# EAGLE design smartstickSTM32f072 (EAGLE 6.5.0)
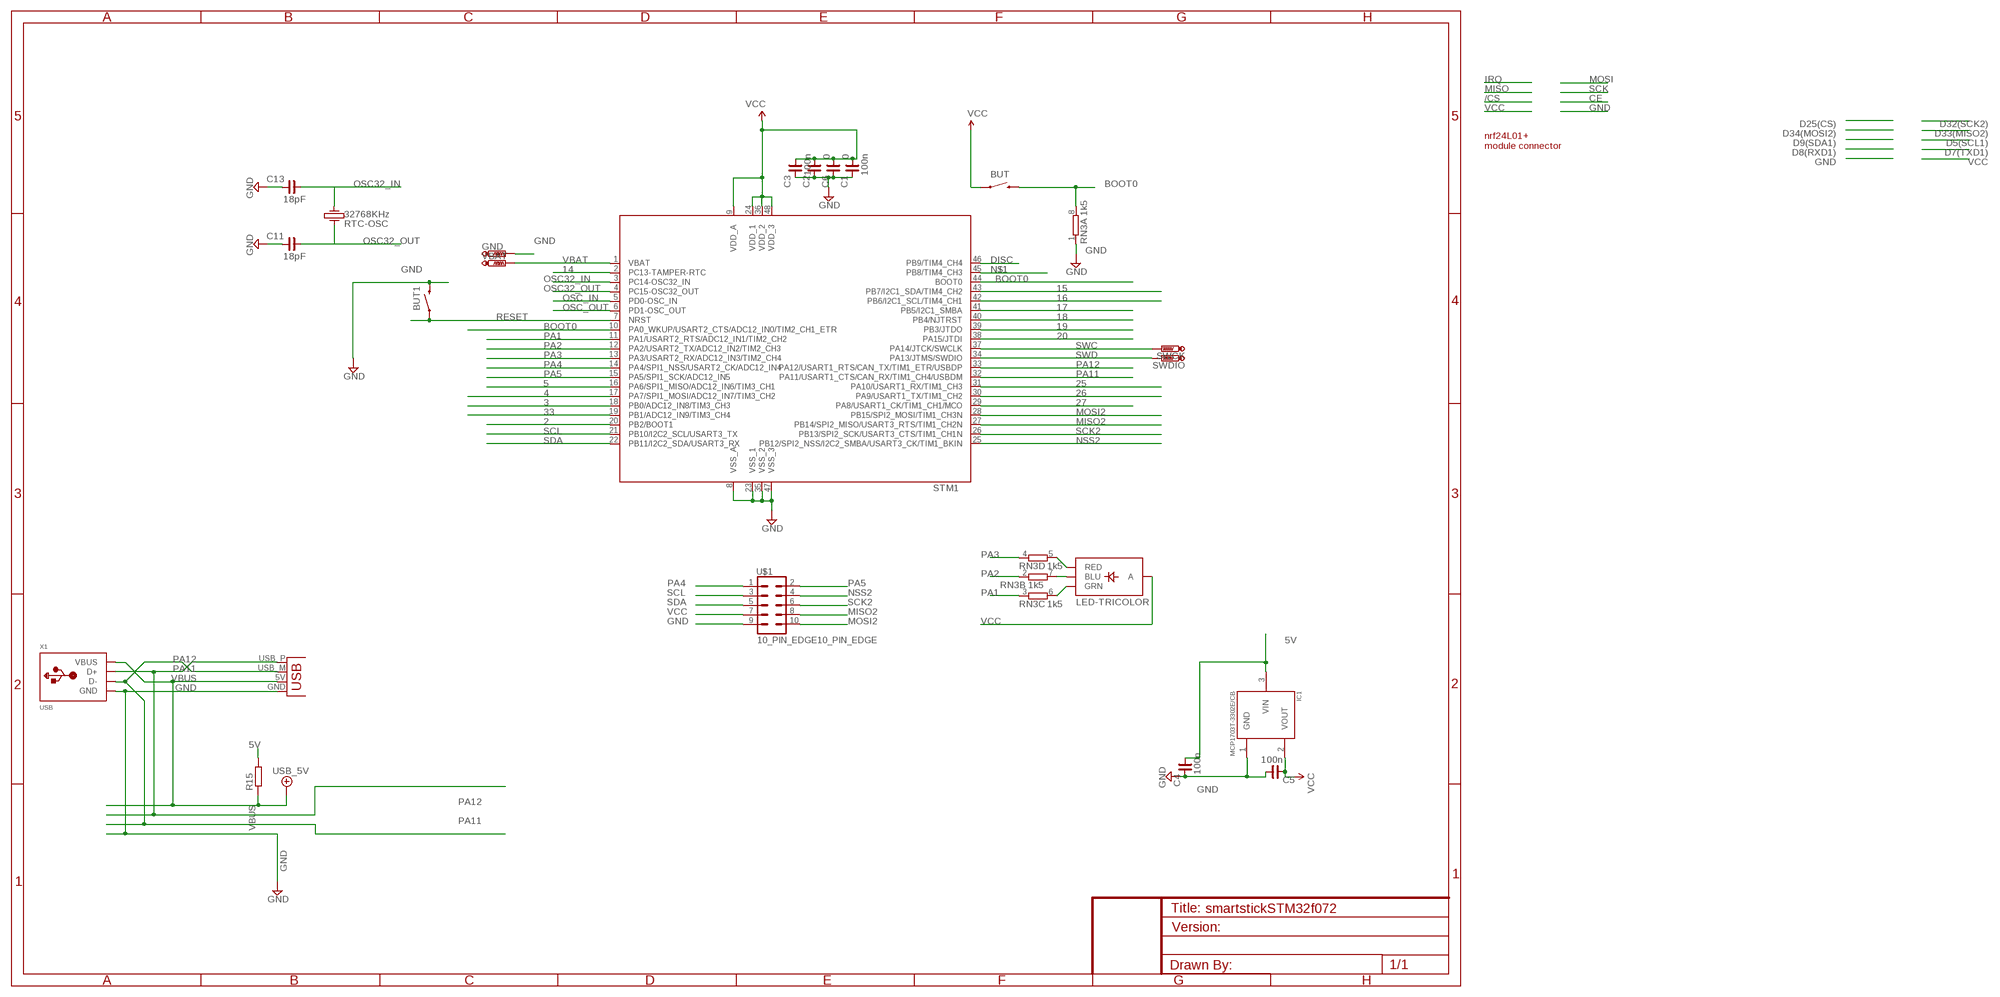
[diagram p0: schematic, sheet 1]

## Parts
BUT  SWITCH-MOMENTARY-2-SMD-1101NE  [TACTILE-SWITCH-1101NE]
BUT1  SWITCH-MOMENTARY-2-SMD-1101NE  [TACTILE-SWITCH-1101NE]
C1  100n  C_0603  [C0603]
C2  0  C_0603  [C0603]
C3  100n  C_0603  [C0603]
C4  100n  C_0603  [C0603]
C5  100n  C_0603  [C0603]
C6  0  C_0603  [C0603]
C11  18pF  C_0603  [C0603]
C13  18pF  C_0603  [C0603]
GND  PTR1TP20SQ  [TP20SQ]
IC1  MCP1703T-3302E/CB  MCP1700T  [SOT23]
R15  R-EU_R0603  [R0603]
RN3  1k5  4R-NEXB38V  [EXB38V]
RTC-OSC  32768KHz  CRYSTALL  [KX-327LT]
STM1  STM32F103CB  [LQFP48]
SWCK  PTR1TP16R  [TP16R]
SWDIO  PTR1TP16R  [TP16R]
U$1  10_PIN_EDGE10_PIN_EDGE  [10_PIN_EDGE]
U$3  LED-TRICOLOR  [LED-TRICOLOR-SMD]
VBAT  PTR1TP19R  [TP19R]
X1  USB  [MOLEX-48037-1000]
X3  USBPCB  [USB-A-PCB]

## Nets
2: STM1.20(PB2/BOOT1)
3: STM1.18(PB0/ADC12_IN8/TIM3_CH3)
4: STM1.17(PA7/SPI1_MOSI/ADC12_IN7/TIM3_CH2)
5: STM1.16(PA6/SPI1_MISO/ADC12_IN6/TIM3_CH1)
5V [vcc]: C4.1 IC1.3(VIN) R15.2
14: STM1.2(PC13-TAMPER-RTC)
15: STM1.43(PB7/I2C1_SDA/TIM4_CH2)
16: STM1.42(PB6/I2C1_SCL/TIM4_CH1)
17: STM1.41(PB5/I2C1_SMBA)
18: STM1.40(PB4/NJTRST)
19: STM1.39(PB3/JTDO)
20: STM1.38(PA15/JTDI)
25: STM1.31(PA10/USART1_RX/TIM1_CH3)
26: STM1.30(PA9/USART1_TX/TIM1_CH2)
27: STM1.29(PA8/USART1_CK/TIM1_CH1/MCO)
33: STM1.19(PB1/ADC12_IN9/TIM3_CH4)
BOOT0: BUT.P$2 RN3.8 STM1.10(PA0_WKUP/USART2_CTS/ADC12_IN0/TIM2_CH1_ETR) STM1.44(BOOT0)
DISC: STM1.46(PB9/TIM4_CH4)
GND [vcc]: BUT1.P$2 C1.2 C2.2 C3.2 C4.2 C5.1 C6.2 C11.2 C13.2 GND.TP IC1.1(GND) RN3.1 STM1.8(VSS_A) STM1.23(VSS_1) STM1.35(VSS_2) STM1.47(VSS_3) U$1.9 X1.4(GND) X3.GND
MISO2: STM1.27(PB14/SPI2_MISO/USART3_RTS/TIM1_CH2N) U$1.8
MOSI2: STM1.28(PB15/SPI2_MOSI/TIM1_CH3N) U$1.10
N$1: STM1.45(PB8/TIM4_CH3)
N$2: RN3.5 U$3.R(RED)
N$3: RN3.7 U$3.B(BLU)
N$4: RN3.6 U$3.G(GRN)
NSS2: STM1.25(PB12/SPI2_NSS/I2C2_SMBA/USART3_CK/TIM1_BKIN) U$1.4
OSC32_IN: C13.1 RTC-OSC.1 STM1.3(PC14-OSC32_IN)
OSC32_OUT: C11.1 RTC-OSC.4 STM1.4(PC15-OSC32_OUT)
OSC_IN: STM1.5(PD0-OSC_IN)
OSC_OUT: STM1.6(PD1-OSC_OUT)
PA1: RN3.3 STM1.11(PA1/USART2_RTS/ADC12_IN1/TIM2_CH2)
PA2: RN3.2 STM1.12(PA2/USART2_TX/ADC12_IN2/TIM2_CH3)
PA3: RN3.4 STM1.13(PA3/USART2_RX/ADC12_IN3/TIM2_CH4)
PA4: STM1.14(PA4/SPI1_NSS/USART2_CK/ADC12_IN4) U$1.1
PA5: STM1.15(PA5/SPI1_SCK/ADC12_IN5) U$1.2
PA11: STM1.32(PA11/USART1_CTS/CAN_RX/TIM1_CH4/USBDM) X1.2(D-) X3.USB_M(D-)
PA12: STM1.33(PA12/USART1_RTS/CAN_TX/TIM1_ETR/USBDP) X1.3(D+) X3.USB_P(D+)
RESET: BUT1.P$1 STM1.7(NRST)
SCK2: STM1.26(PB13/SPI2_SCK/USART3_CTS/TIM1_CH1N) U$1.6
SCL: STM1.21(PB10/I2C2_SCL/USART3_TX) U$1.3
SDA: STM1.22(PB11/I2C2_SDA/USART3_RX) U$1.5
SWC: STM1.37(PA14/JTCK/SWCLK) SWCK.TP
SWD: STM1.34(PA13/JTMS/SWDIO) SWDIO.TP
VBAT: STM1.1(VBAT) VBAT.TP
VBUS: R15.1 X1.1(VBUS) X3.5V(VBUS) ; supply symbol labelled USB_5V
VCC [vcc]: BUT.P$1 C1.1 C2.1 C3.1 C5.2 C6.1 IC1.2(VOUT) STM1.9(VDD_A) STM1.24(VDD_1) STM1.36(VDD_2) STM1.48(VDD_3) U$1.7 U$3.A

## Notes on the sheet
- nrf24L01+ 
  module connector
- BOOT0

## Library data of the parts
BUT BUT1 = SparkFun:SWITCH-MOMENTARY-2
C1-C6 C11 C13 = rc-master-smd:C_: NON-POLARIZED CAP
GND SWCK SWDIO VBAT = testpad:PTR1: TEST PIN
IC1 = okie:MCP1700T
R15 = resistor:R-EU_: RESISTOR, European symbol
RN3 = resistor-dil:4R-N: Array Chip Resistor Source: RS Component / Phycomp; OC_FARNELL: unknown; OC_NEWARK: unknown
RTC-OSC = es:CRYSTALL
STM1 = stm32:STM32F103CB
U$1 = eclibrary:10_PIN_EDGE
U$3 = SparkFun-LED:LED-TRICOLOR: Tri-Color LED SMD Proven layout and schematic for triple color LED in SMD package - common anode. Spark Fun Electronics SKU : COM-07844
X1 = todstuff:USB
X3 = SparkFun:USB: USB Connectors USB-B-PTH is fully proven SKU : PRT-00139 USB-miniB is fully proven SKU : PRT-00587 USB-A-PCB is untested. USB-A-H is throughly reviewed, but untested. Spark Fun Electronics SKU : PRT-00437 USB-B-SMT is throughly reviewed, but untested. Needs silkscreen touching up. USB-A-S has not been used/tested USB-MB-H has not been used/tested

## Net classes
0 default: width 0.178 mm, drill 0.356 mm, clearance 0.178 mm
1 vcc: width 0.178 mm, drill 0.356 mm, clearance 0.178 mm
2 pwr: width 0.178 mm, drill 0.356 mm, clearance 0.178 mm

## Board
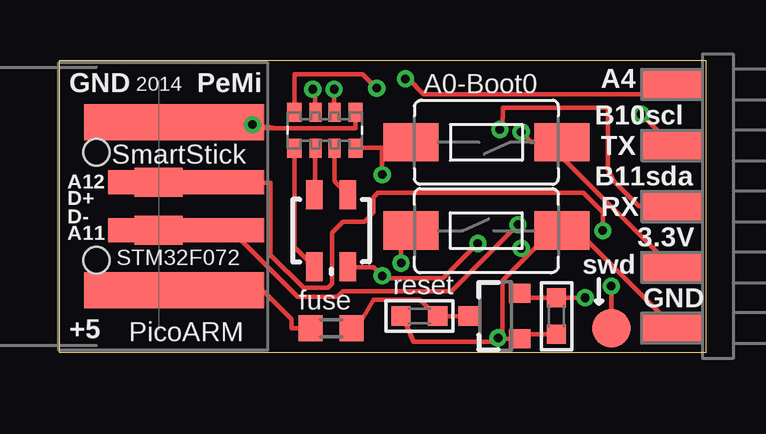
[diagram p1: board, top side]
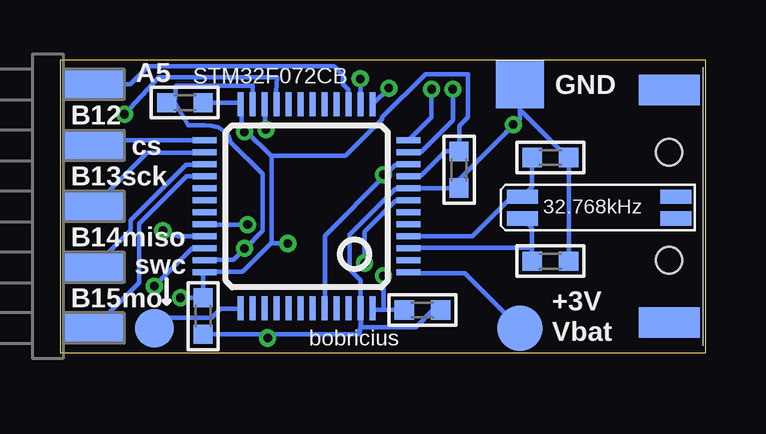
[diagram p2: board, bottom side, seen from below]

Size 26.92 x 12.19 mm. Coordinates in mm from the lower left corner, seen from the top.
Outline: 0,12.19 26.92,12.19 26.92,0 0,0 0,12.19
Copper layers (1*16): Top 0.0356mm / dielectric 1.5011mm / Bottom 0.0356mm
Design rules "LaenPCBOrder *": minimum track width 6mil, minimum drill 13mil, track to track 6mil, track to pad 6mil, pad to pad 6mil, via to via 6mil, smd to smd 6mil, copper to edge 15mil, drill to drill 6mil, minimum pad ring 7mil, minimum via ring 7mil, stop-mask expansion 3mil, vias tented up to drill 100mil, thermal gap 10mil
tRestrict: area 0.1,0.8 to 3.2,11.7
vRestrict: area 0.1,0.8 to 8,11.7

### Footprints (pad centres in the part's own frame; a part is rotated, then mirrored left to right if it is on the bottom)
TACTILE-SWITCH-1101NE = smd 2.3 x 1.6: P$1 -3.15,0; P$2 3.15,0
C0603 = smd 0.8 x 0.8: 1 -0.762,0; 2 0.762,0
TP20SQ = smd 2 x 2: TP 0,0
SOT23 = smd 0.8 x 0.9: 1 -0.95,-1; 2 0.95,-1; 3 0,1.1
R0603 = smd 1 x 1.1: 1 -0.85,0; 2 0.85,0
EXB38V = smd 0.6 x 0.8: 1 -1.275,-0.75; 4 1.275,-0.75; 5 1.275,0.75; 8 -1.275,0.75 | smd 0.5 x 0.8: 2 -0.4,-0.75; 3 0.4,-0.75; 6 0.4,0.75; 7 -0.4,0.75
KX-327LT = smd 1.3 x 0.6: 1 -3.2,-0.5; 2 3.2,-0.5; 3 3.2,0.4; 4 -3.2,0.4
LQFP48 = smd 0.254 x 1: 1 -2.75,-4.25; 2 -2.25,-4.25; 3 -1.75,-4.25; 4 -1.25,-4.25; 5 -0.75,-4.25; 6 -0.25,-4.25; 7 0.25,-4.25; 8 0.75,-4.25; 9 1.25,-4.25; 10 1.75,-4.25; 11 2.25,-4.25; 12 2.75,-4.25; 25 2.75,4.25; 26 2.25,4.25; 27 1.75,4.25; 28 1.25,4.25; 29 0.75,4.25; 30 0.25,4.25; 31 -0.25,4.25; 32 -0.75,4.25; 33 -1.25,4.25; 34 -1.75,4.25; 35 -2.25,4.25; 36 -2.75,4.25 | smd 1 x 0.254: 13 4.25,-2.75; 14 4.25,-2.25; 15 4.25,-1.75; 16 4.25,-1.25; 17 4.25,-0.75; 18 4.25,-0.25; 19 4.25,0.25; 20 4.25,0.75; 21 4.25,1.25; 22 4.25,1.75; 23 4.25,2.25; 24 4.25,2.75; 37 -4.25,2.75; 38 -4.25,2.25; 39 -4.25,1.75; 40 -4.25,1.25; 41 -4.25,0.75; 42 -4.25,0.25; 43 -4.25,-0.25; 44 -4.25,-0.75; 45 -4.25,-1.25; 46 -4.25,-1.75; 47 -4.25,-2.25; 48 -4.25,-2.75
TP16R = smd 1.6 x 1.6: TP 0,0
10_PIN_EDGE = smd 1.27 x 2.54: 1 5.08,0; 3 2.54,0; 5 0,0; 7 -2.54,0; 9 -5.08,0 | smd 1.27 x 2.54 bottom: 2 5.08,0; 4 2.54,0; 6 0,0; 8 -2.54,0; 10 -5.08,0
LED-TRICOLOR-SMD = smd 0.7 x 1.2: A 0.7,-1.5; B 0.7,1.5; G -0.7,1.5; R -0.7,-1.5
TP19R = smd 1.9 x 1.9: TP 0,0
MOLEX-48037-1000 = smd 2 x 1.2: 1 2.6,-3.5; 2 2.6,-1; 3 2.6,1; 4 2.6,3.5 | smd 2.54 x 1.27 bottom: P$1 0,4.85; P$2 0,-4.85 | hole 1.1: 0,2.25; 0,-2.25
USB-A-PCB = smd 7.5 x 1.5: 5V -0.2,-3.5; GND -0.2,3.5 | smd 6.5 x 1: USB_M 0.3,-1; USB_P 0.3,1

### Placement (x,y rotation side)
BUT  17.78,8.76 180 top
BUT1  17.78,5.08 0 top
C1  20.96,1.52 270 bottom
C2  11.81,1.78 0 bottom
C3  10.29,7.62 270 bottom
C4  14.99,1.52 180 top
C5  21.72,10.41 0 bottom
C6  20.7,1.52 270 top
C11  6.48,8.13 0 bottom
C13  6.48,3.81 0 bottom
GND  7.75,11.18 0 bottom
IC1  18.16,1.52 90 top
R15  11.3,1.02 0 top
RN3  11.05,9.27 180 top
RTC-OSC  4.45,6.1 0 bottom
STM1  16.64,6.1 90 bottom
SWCK  22.99,1.02 0 bottom
SWDIO  22.99,1.02 270 top
U$1  25.53,6.1 90 top
U$3  11.3,5.08 0 top
VBAT  7.75,1.02 0 bottom
X1  1.52,6.1 0 top
X3  4.95,6.1 0 top

### Tracks (layer width: path | path; a pad name or v marks a point on that pad's centre or on a via)
5V
  Top 0.178: IC1.3 C4.1 15.67,1.55 15.01,2.21 13.08,2.21 12.39,1.02 R15.2
BOOT0  (via drill 0.36)
  Top 0.178: 13.44,8.53 14.38,8.53 14.6,8.76 BUT.P$2 | 13.44,8.53 12.34,8.53 RN3.8 | v13.44,7.42 13.44,8.53
  Bottom 0.178: 13.39,7.37 15.88,4.88 15.88,1.85 STM1.44 | 13.39,7.37 12.93,7.82 12.39,7.82 STM1.10 | v13.44,7.42 13.39,7.37
GND  (via drill 0.36)
  Top 0.178: C6.2 19.36,0.76 19.18,0.58 IC1.1 19.07,0.58 18.44,0.58 | C4.2 14.3,1.52 14.73,0.46 18.26,0.46 | 18.44,0.58 18.26,0.46 | 19.51,4.06 18.44,3 18.44,0.58 | 19.51,4.06 20.52,5.08 BUT1.P$2 21.01,5.05 21.59,5.05 25.53,1.12 U$1.9 | 19.51,4.06 v19.23,4.34 | 9.04,9.35 5,9.35 4.77,9.58 X3.GND 3.99,9.6 X1.4 | 9.04,9.35 12.32,9.35 12.32,10.01 RN3.1 | v8.03,9.5 9.04,9.35 | v18.26,0.61 18.26,0.46
  Bottom 0.178: STM1.23 18.9,10.36 18.9,11.12 22.07,11.12 22.15,10.41 C5.1 22.1,10.36 21.59,9.47 20.88,9.47 20.62,9.45 20.32,9.4 19.94,9.14 19.81,8.76 18.47,7.44 18.47,5.08 19.21,4.33 | 19.21,4.33 19.68,3.86 20.88,3.86 STM1.35 | v19.23,4.34 19.21,4.33 | C2.2 11.38,1.78 12.09,1.07 14.38,1.07 14.38,1.32 | 14.38,1.32 14.38,1.83 STM1.47 14.4,1.93 14.4,3.02 14.86,3.48 14.86,4.9 12.93,6.83 12.47,6.83 STM1.8 12.37,6.86 C3.2 10.26,6.93 10.26,7.21 8.64,8.84 | 17.88,0.76 14.43,0.76 14.38,1.32 | 17.88,0.76 C1.2 | C13.2 C11.2 5.79,8.15 7.67,10.03 7.75,10.03 | 8.64,8.84 7.75,9.73 7.75,10.03 | GND.TP 7.75,10.03 | 8.64,8.84 v8.03,9.5 | v18.26,0.61 17.88,0.76
MISO2
  Bottom 0.178: U$1.8 23.98,5.11 23.98,5.51 21.67,7.82 20.9,7.82 STM1.27
MOSI2
  Bottom 0.178: U$1.10 23.62,2.92 23.62,5.36 21.64,7.34 20.9,7.34 STM1.28
N$2
  Top 0.178: RN3.5 9.78,8.51 9.78,4.39 10.59,3.58 U$3.R
N$3
  Top 0.178: RN3.7 11.46,8.51 11.46,7.14 11.99,6.6 U$3.B
N$4
  Top 0.178: RN3.6 10.64,8.51 10.64,6.63 10.62,6.6 U$3.G
NSS2
  Bottom 0.178: U$1.4 25.32,8.84 20.9,8.84 STM1.25
OSC32_IN
  Bottom 0.178: 7.24,4.37 7.24,5.21 7.62,5.59 RTC-OSC.1 | 7.24,4.37 C13.1 | 7.24,4.37 12.37,4.37 STM1.3
OSC32_OUT
  Bottom 0.178: C11.1 7.24,6.88 7.62,6.5 RTC-OSC.4 7.72,6.45 8.13,6.45 9.73,4.85 12.37,4.85 STM1.4
PA1  (via drill 0.36)
  Top 0.178: v10.54,10.97 10.64,10.87 RN3.3
  Bottom 0.178: v10.54,10.97 10.54,9.68 11.86,8.36 12.37,8.36 STM1.11
PA2  (via drill 0.36)
  Top 0.178: v11.43,10.97 11.43,10.03 RN3.2
  Bottom 0.178: v11.43,10.97 11.43,9.8 12.37,8.86 STM1.12
PA3  (via drill 0.36)
  Top 0.178: v13.21,11.02 12.62,11.61 9.78,11.61 RN3.4
  Bottom 0.178: v13.21,11.02 13.87,10.36 STM1.13
PA4  (via drill 0.36)
  Top 0.178: v14.4,11.41 14.53,11.41 15.16,10.77 25.12,10.77 U$1.1
  Bottom 0.178: v14.4,11.41 14.4,10.36 STM1.14
PA5
  Bottom 0.178: STM1.15 14.89,10.95 15.11,11.18 15.11,11.56 15.49,11.94 23.24,11.94 24,11.18 U$1.2
PA11  (via drill 0.36)
  Top 0.178: v19.1,5.33 16.33,2.57 11.81,2.57 11.58,2.34 9.91,2.34 7.16,5.08 5.26,5.08 X3.USB_M 5.18,5.11 4.01,5.11 X1.2
  Bottom 0.178: v19.1,5.33 STM1.32
PA12  (via drill 0.36)
  Top 0.178: v22.63,5.08 22.63,5.84 21.82,6.66 13.23,6.66 13.21,6.6 13.08,6.48 13.08,5.84 12.7,5.46 11.81,5.46 11.35,5 11.35,2.87 11.18,2.69 10.16,2.69 8.79,4.06 8.79,7.09 X3.USB_P 5.18,7.09 4.01,7.09 X1.3
  Bottom 0.178: v22.63,5.08 22.02,4.85 20.9,4.85 STM1.33
RESET  (via drill 0.36)
  Top 0.178: v14.22,3.73 14.22,4.7 14.6,5.08 BUT1.P$1
  Bottom 0.178: v14.22,3.73 14.22,5.03 12.93,6.32 12.39,6.32 STM1.7
SCK2
  Bottom 0.178: U$1.6 23.29,8.33 20.9,8.33 STM1.26
SCL  (via drill 0.36)
  Top 0.178: U$1.3 v24.23,9.93
  Bottom 0.178: v24.23,9.93 22.81,11.48 17.88,11.48 17.91,10.87 17.91,10.36 STM1.21
SDA  (via drill 0.36)
  Top 0.178: v18.34,9.3 18.44,9.3 18.47,10.21 22.84,10.21 22.84,7.64 23.09,7.14 24.13,6.1 U$1.5
  Bottom 0.178: v18.34,9.3 18.36,9.32 18.36,10.34 STM1.22
SWC
  Bottom 0.178: SWCK.TP 22.55,1.45 20.6,1.45 20.22,1.83 19.41,1.83 STM1.37
SWD  (via drill 0.36)
  Top 0.178: SWDIO.TP v22.99,2.77
  Bottom 0.178: v22.99,2.77 21.41,4.34 20.9,4.34 STM1.34
VBAT
  Bottom 0.178: STM1.1 12.32,3.3 10.03,3.3 VBAT.TP
VBUS
  Top 0.178: R15.1 9.65,1.02 9.65,1.4 8.51,2.54 4.77,2.59 | 4.77,2.59 X1.1 | 4.77,2.59 X3.5V
VCC  (via drill 0.36)
  Top 0.178: U$1.7 20.96,8.13 20.96,8.76 BUT.P$1 20.85,8.79 19.63,8.79 v19.23,9.2 | U$3.A 12.01,3.56 13.08,3.56 v13.44,3.2 13.51,3.18 13.59,3.1 15.98,3.1 v17.42,4.55 | IC1.2 19.18,2.46 19.36,2.29 C6.1 v21.89,2.29
  Bottom 0.178: 13.44,1.78 13.82,1.78 13.87,1.83 STM1.48 | 13.44,1.78 C2.1 | 13.44,1.78 v13.44,3.2 | STM1.9 12.37,7.37 11.86,7.37 10.85,8.38 C3.1 10.26,8.46 10.26,9.45 9.91,9.8 9.91,11.61 11.68,11.61 13.49,9.8 13.49,9.73 15.01,8.2 18.03,8.2 18.11,8.18 | C5.2 19.46,10.41 19.41,10.36 STM1.24 19.36,10.26 19.36,9.42 19.18,9.25 | 18.11,4.57 19.3,3.38 20.8,3.38 STM1.36 20.9,3.33 20.96,3.28 C1.1 v21.89,2.29 | 18.11,8.18 18.11,4.57 | 19.18,9.25 18.11,8.18 | v17.42,4.55 18.03,4.55 18.11,4.57 | v19.23,9.2 19.18,9.25

### Text on the board
tNames: A4 | GND | 2014 | PeMi | A0-Boot0 | B10scl | TX | SmartStick | A12 | D+ | B11sda | D- | RX | A11 | 3.3V | STM32F072 | swd | reset | fuse | GND | +5 | PicoARM
bNames: A5 | STM32F072CB | GND | B12 | cs | B13sck | 32.768kHz | B14miso | swc | +3V | B15mo | Vbat | bobricius